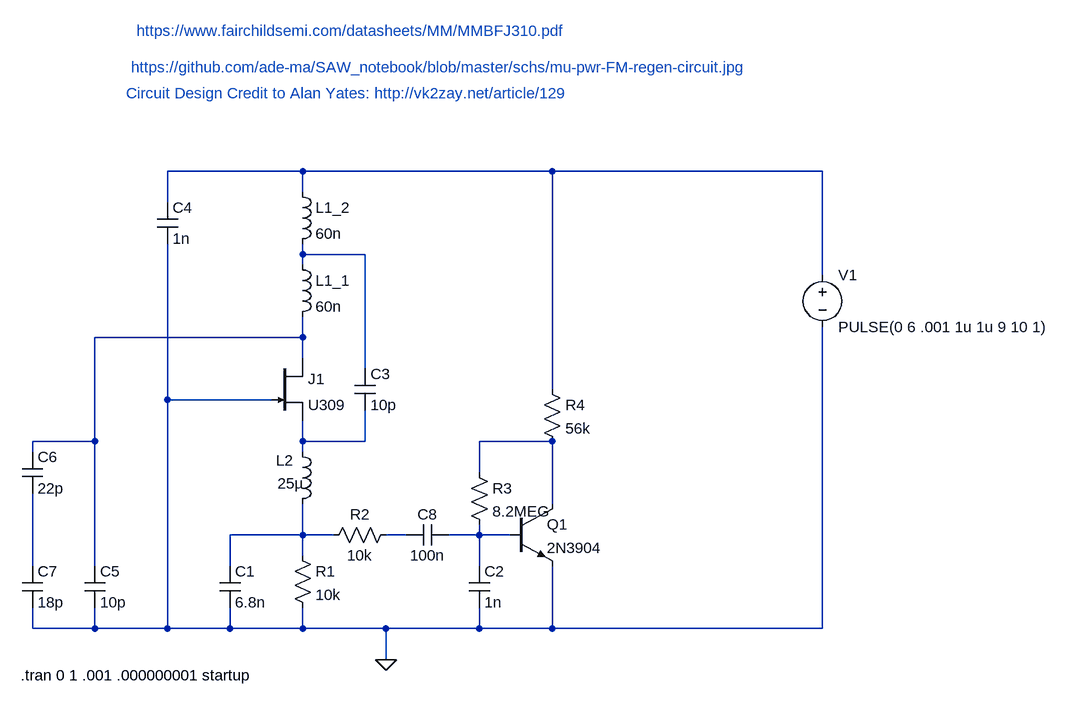
[diagram p0: schematic Super_regen_FM_RX.asc]
Super_regen_FM_RX.asc, the LTspice schematic file:
Version 4
SHEET 1 1512 680
WIRE 320 -400 112 -400
WIRE 704 -400 320 -400
WIRE 1120 -400 704 -400
WIRE 320 -368 320 -400
WIRE 112 -352 112 -400
WIRE 320 -272 320 -288
WIRE 416 -272 320 -272
WIRE 320 -256 320 -272
WIRE 1120 -240 1120 -400
WIRE 320 -144 320 -176
WIRE 320 -144 0 -144
WIRE 320 -112 320 -144
WIRE 416 -96 416 -272
WIRE 704 -64 704 -400
WIRE 112 -48 112 -288
WIRE 272 -48 112 -48
WIRE 0 16 0 -144
WIRE 0 16 -96 16
WIRE 320 16 320 -16
WIRE 416 16 416 -32
WIRE 416 16 320 16
WIRE 704 16 592 16
WIRE -96 32 -96 16
WIRE 320 32 320 16
WIRE 592 64 592 16
WIRE 704 112 704 16
WIRE 320 160 320 112
WIRE 320 160 208 160
WIRE 368 160 320 160
WIRE 480 160 448 160
WIRE 592 160 592 144
WIRE 592 160 544 160
WIRE 640 160 592 160
WIRE 320 192 320 160
WIRE -96 208 -96 96
WIRE 0 208 0 16
WIRE 208 208 208 160
WIRE 592 208 592 160
WIRE -96 304 -96 272
WIRE 0 304 0 272
WIRE 0 304 -96 304
WIRE 112 304 112 -48
WIRE 112 304 0 304
WIRE 208 304 208 272
WIRE 208 304 112 304
WIRE 320 304 320 272
WIRE 320 304 208 304
WIRE 448 304 320 304
WIRE 592 304 592 272
WIRE 592 304 448 304
WIRE 704 304 704 208
WIRE 704 304 592 304
WIRE 1120 304 1120 -160
WIRE 1120 304 704 304
WIRE 448 352 448 304
FLAG 448 352 0
SYMBOL cap 192 208 R0
SYMATTR InstName C1
SYMATTR Value 6.8n
SYMBOL res 304 176 R0
SYMATTR InstName R1
SYMATTR Value 10k
SYMBOL res 352 176 R270
WINDOW 0 32 56 VTop 2
WINDOW 3 0 56 VBottom 2
SYMATTR InstName R2
SYMATTR Value 10k
SYMBOL ind 304 16 R0
WINDOW 0 -25 29 Left 2
WINDOW 3 -23 65 Left 2
SYMATTR InstName L2
SYMATTR Value 25µ
SYMBOL cap 576 208 R0
SYMATTR InstName C2
SYMATTR Value 1n
SYMBOL res 576 48 R0
SYMATTR InstName R3
SYMATTR Value 8.2MEG
SYMBOL res 688 -80 R0
SYMATTR InstName R4
SYMATTR Value 56k
SYMBOL njf 272 -112 R0
SYMATTR InstName J1
SYMATTR Value U309
SYMBOL cap 400 -96 R0
SYMATTR InstName C3
SYMATTR Value 10p
SYMBOL ind 304 -272 R0
SYMATTR InstName L1_1
SYMATTR Value 60n
SYMBOL ind 304 -384 R0
SYMATTR InstName L1_2
SYMATTR Value 60n
SYMBOL cap 96 -352 R0
SYMATTR InstName C4
SYMATTR Value 1n
SYMBOL cap -16 208 R0
SYMATTR InstName C5
SYMATTR Value 10p
SYMBOL cap -112 32 R0
SYMATTR InstName C6
SYMATTR Value 22p
SYMBOL cap -112 208 R0
SYMATTR InstName C7
SYMATTR Value 18p
SYMBOL npn 640 112 R0
SYMATTR InstName Q1
SYMATTR Value 2N3904
SYMBOL cap 480 176 R270
WINDOW 0 32 32 VTop 2
WINDOW 3 0 32 VBottom 2
SYMATTR InstName C8
SYMATTR Value 100n
SYMBOL voltage 1120 -256 R0
WINDOW 123 0 0 Left 2
WINDOW 39 0 0 Left 2
SYMATTR InstName V1
SYMATTR Value PULSE(0 6 .001 1u 1u 9 10 1)
TEXT 64 -616 Left 2 ;https://www.fairchildsemi.com/datasheets/MM/MMBFJ310.pdf
TEXT -114 376 Left 2 !.tran 0 1 .001 .000000001 startup
TEXT 56 -560 Left 2 ;https://github.com/ade-ma/SAW_notebook/blob/master/schs/mu-pwr-FM-regen-circuit.jpg
TEXT 48 -520 Left 2 ;Circuit Design Credit to Alan Yates: http://vk2zay.net/article/129

The netlist it stands for:
* Super_regen_FM_RX.asc
C1 N006 0 6.8n
R1 N006 0 10k
R2 N006 N007 10k
L2 N004 N006 25µ
C2 N008 0 1n
R3 N005 N008 8.2MEG
R4 N001 N005 56k
J1 N003 0 N004 U309
C3 N002 N004 10p
L1_1 N002 N003 60n
L1_2 N001 N002 60n
C4 N001 0 1n
C5 N003 0 10p
C6 N003 N009 22p
C7 N009 0 18p
Q1 N005 N008 0 0 2N3904
C8 N007 N008 100n
V1 N001 0 PULSE(0 6 .001 1u 1u 9 10 1)
.model NPN NPN
.model PNP PNP
.lib standard.bjt
.model NJF NJF
.model PJF PJF
.lib standard.jft
* https://www.fairchildsemi.com/datasheets/MM/MMBFJ310.pdf
.tran 0 1 .001 .000000001 startup
* https://github.com/ade-ma/SAW_notebook/blob/master/schs/mu-pwr-FM-regen-circuit.jpg
* Circuit Design Credit to Alan Yates: http://vk2zay.net/article/129
.backanno
.end